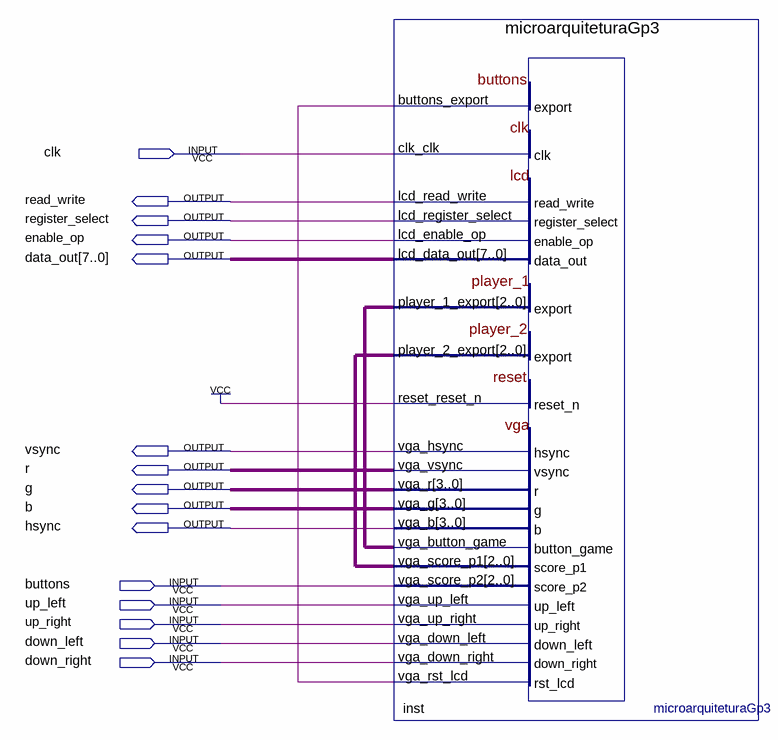
[diagram p0: schematic sheet]
// Quartus schematic pong.bdf as structural Verilog: 1 symbols, 15 pins
module pong (
  input  clk,
  input  buttons,
  input  up_left,
  input  up_right,
  input  down_left,
  input  down_right,
  output read_write,
  output register_select,
  output enable_op,
  output [7:0] data_out,
  output vsync,
  output r,
  output g,
  output b,
  output hsync
);

  wire inst_vga_rst_lcd;
  wire [2:0] inst_vga_score_p1, undriven;
  wire [3:0] inst_vga_g, inst_vga_r;

  microarquiteturaGp3 inst (
    .buttons_export(inst_vga_rst_lcd), .clk_clk(clk), .player_1_export(undriven),
    .player_2_export(inst_vga_score_p1), .reset_reset_n(1'b1), .vga_button_game(undriven),
    .vga_up_left(up_left), .vga_up_right(up_right), .vga_down_left(down_left), .vga_down_right(down_right),
    .lcd_read_write(read_write), .lcd_register_select(register_select), .lcd_enable_op(enable_op),
    .lcd_data_out(data_out), .vga_hsync(vsync), .vga_vsync(r), .vga_r(inst_vga_r), .vga_g(inst_vga_g),
    .vga_b(hsync), .vga_score_p1(inst_vga_score_p1), .vga_score_p2(buttons), .vga_rst_lcd(inst_vga_rst_lcd));
endmodule
